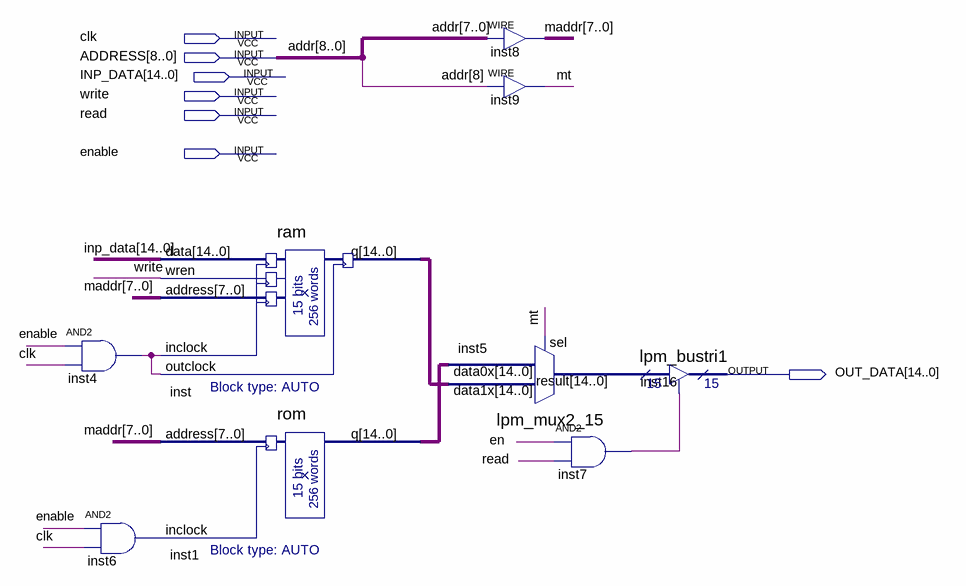
[diagram p0: schematic sheet]
// Quartus schematic MEMORY.bdf as structural Verilog: 9 symbols, 7 pins
module MEMORY (
  input  clk,
  input  [8:0] ADDRESS,
  input  [14:0] INP_DATA,
  input  write,
  input  read,
  input  enable,
  output [14:0] OUT_DATA
);

  wire en, inst4_out, inst6_out, inst7_out, mt;
  wire [7:0] maddr;
  wire [14:0] inst1_q, inst5_result, inst_q;

  and inst4 (inst4_out, enable, clk);
  and inst6 (inst6_out, enable, clk);
  ram inst (.data(INP_DATA), .wren(write), .address(maddr), .inclock(inst4_out), .outclock(inst4_out), .q(inst_q));
  rom inst1 (.address(maddr), .inclock(inst6_out), .q(inst1_q));
  assign maddr = ADDRESS[7:0];  // WIRE inst8
  assign mt = ADDRESS[8];  // WIRE inst9
  lpm_mux2_15 inst5 (.data1x(inst_q), .data0x(inst1_q), .sel(mt), .result(inst5_result));
  and inst7 (inst7_out, en, read);
  lpm_bustri1 inst16 (.enabledt(inst7_out), .data(inst5_result), .tridata(OUT_DATA));

  // Other names for the same wires on the sheet: addr[8:0] = ADDRESS
endmodule
